# EAGLE design mains_led (EAGLE 7.5.0)
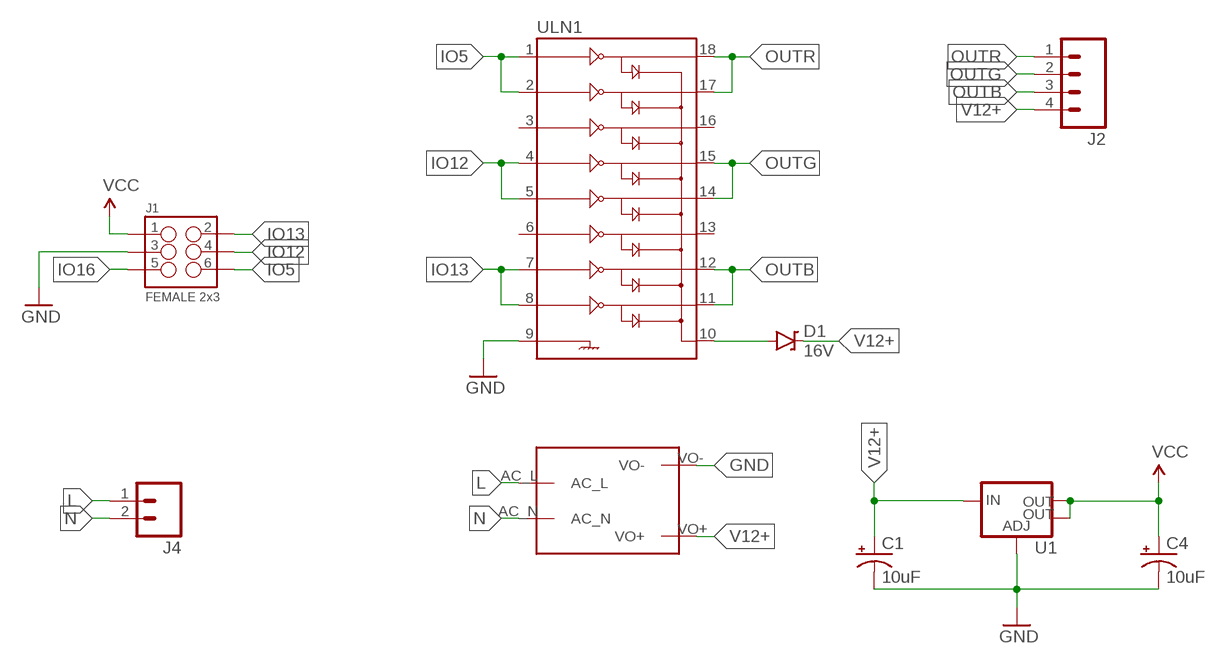
[diagram p0: schematic, sheet 1]

## Parts
C1  10uF  CAP_POL1206-KIT  [EIA3216-KIT]
C4  10uF  CAP_POL1206-KIT  [EIA3216-KIT]
D1  16V  DIODE-ZENER16V  [SOD-123]
J1  FEMALE 2x3  M03X2SHROUD  [2X3-SHROUDED]
J2  M04NO_SILK_ALL_ROUND  [1X04_NO_SILK_ALL_ROUND]
J4  M023.5MM  [SCREWTERMINAL-3.5MM-2]
U1  V_REG_LM1117SOT223  [SOT223]
U$1  MAINS_CONVERTERS  [HLK-PM01]
ULN1  ULN2803SOICW  [SO18L]

## Nets
GND: C1.C(-) C4.C(-) J1.3 U1.1(ADJ) U$1.VO- ULN1.9
IO5: J1.6 ULN1.1 ULN1.2
IO12: J1.4 ULN1.4 ULN1.5
IO13: J1.2 ULN1.7 ULN1.8
IO16: J1.5
L: J4.1 U$1.AC_L
N: J4.2 U$1.AC_N
N$1: D1.A ULN1.10
OUTB: J2.3 ULN1.11 ULN1.12
OUTG: J2.2 ULN1.14 ULN1.15
OUTR: J2.1 ULN1.17 ULN1.18
V12+: C1.A(+) D1.C J2.4 U1.3(IN) U$1.VO+
VCC: C4.A(+) J1.1 U1.2(OUT) U1.4(OUT)
Unconnected: ULN1.3 ULN1.6 ULN1.13 ULN1.16

## Library data of the parts
C1 C4 = SparkFun-Capacitors:CAP_POL: Capacitor Polarized These are standard SMD and PTH capacitors. Normally 10uF, 47uF, and 100uF in electrolytic and tantalum varieties. Always verify the external diameter of the through hole cap, it varies with capacity, voltage, and manufacturer. The EIA devices should be standard.
D1 = SparkFun-DiscreteSemi:DIODE-ZENER: Zener Diode Production Part - 8199 3.4V Zener Voltage; PROD_ID: DIO-12440
J1 = SparkFun-Connectors:M03X2: 2x3 .1" header. Shrouded, with keying- CONN-10681 SMT- CONN-11415 Pogo pins- HW-11044; PROD_ID: CONN-10681
J2 = SparkFun-Connectors:M04: Header 4 Standard 4-pin 0.1" header. Use with straight break away headers (SKU : PRT-00116), right angle break away headers (PRT-00553), swiss pins (PRT-00743), machine pins (PRT-00117), and female headers (PRT-00115). Molex polarized connector foot print use with SKU : PRT-08231 with associated crimp pins and housings. 1MM SMD Version SKU: PRT-10208; PROD_ID: CONN-09696
J4 = SparkFun-Connectors:M02: Standard 2-pin 0.1" header. Use with - straight break away headers ( PRT-00116) - right angle break away headers (PRT-00553) - swiss pins (PRT-00743) - machine pins (PRT-00117) - female headers (PRT-00115) Molex polarized connector foot print use with: PRT-08233 with associated crimp pins and housings. 2.54_SCREWTERM for use with PRT-10571. 3.5mm Screw Terminal footprints for PRT-08084 5mm Screw Terminal footprints for use with PRT-08432; PROD_ID: CONN-08399
U1 = SparkFun-PowerIC:V_REG_LM1117: Voltage Regulator LM1117 Standard adjustable voltage regulator but in SMD form. Spark Fun Electronics SKU : COM-00595; PROD_ID: VREG-08170
U$1 = captain-slow:MAINS_CONVERTERS
ULN1 = SparkFun-PowerIC:ULN2803: Darlington Driver ULN2803 Darlington array. 500mA max per channel, 8-channel package. Spark Fun Electronics SKU : COM-00312

## Board
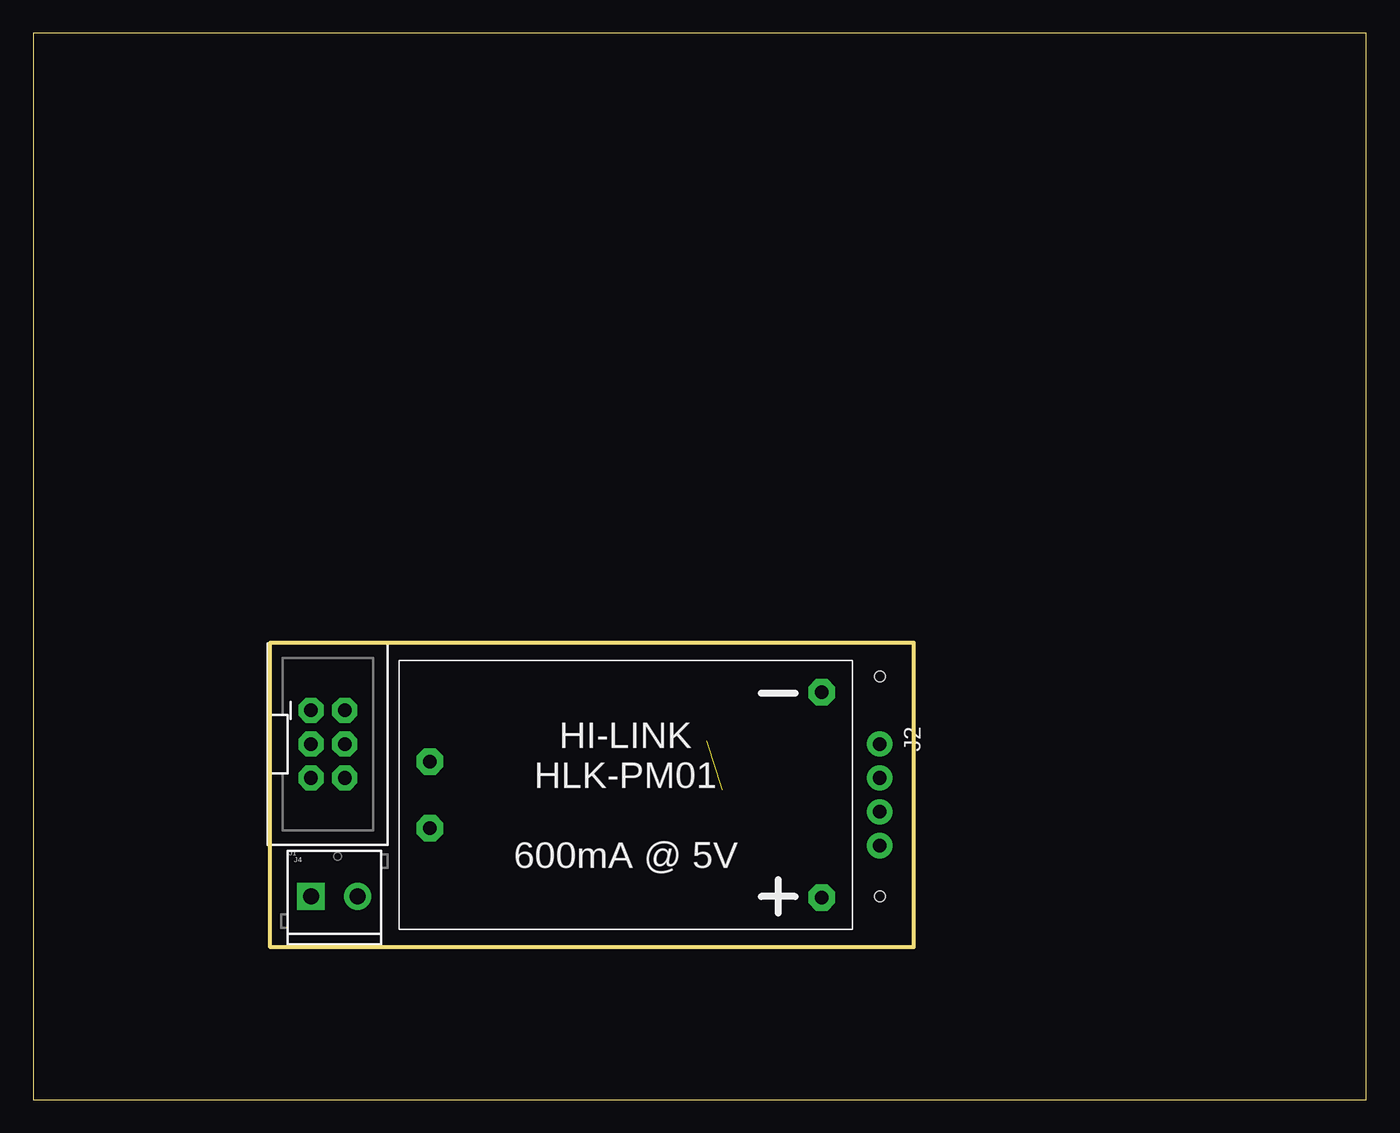
[diagram p1: board, top side]
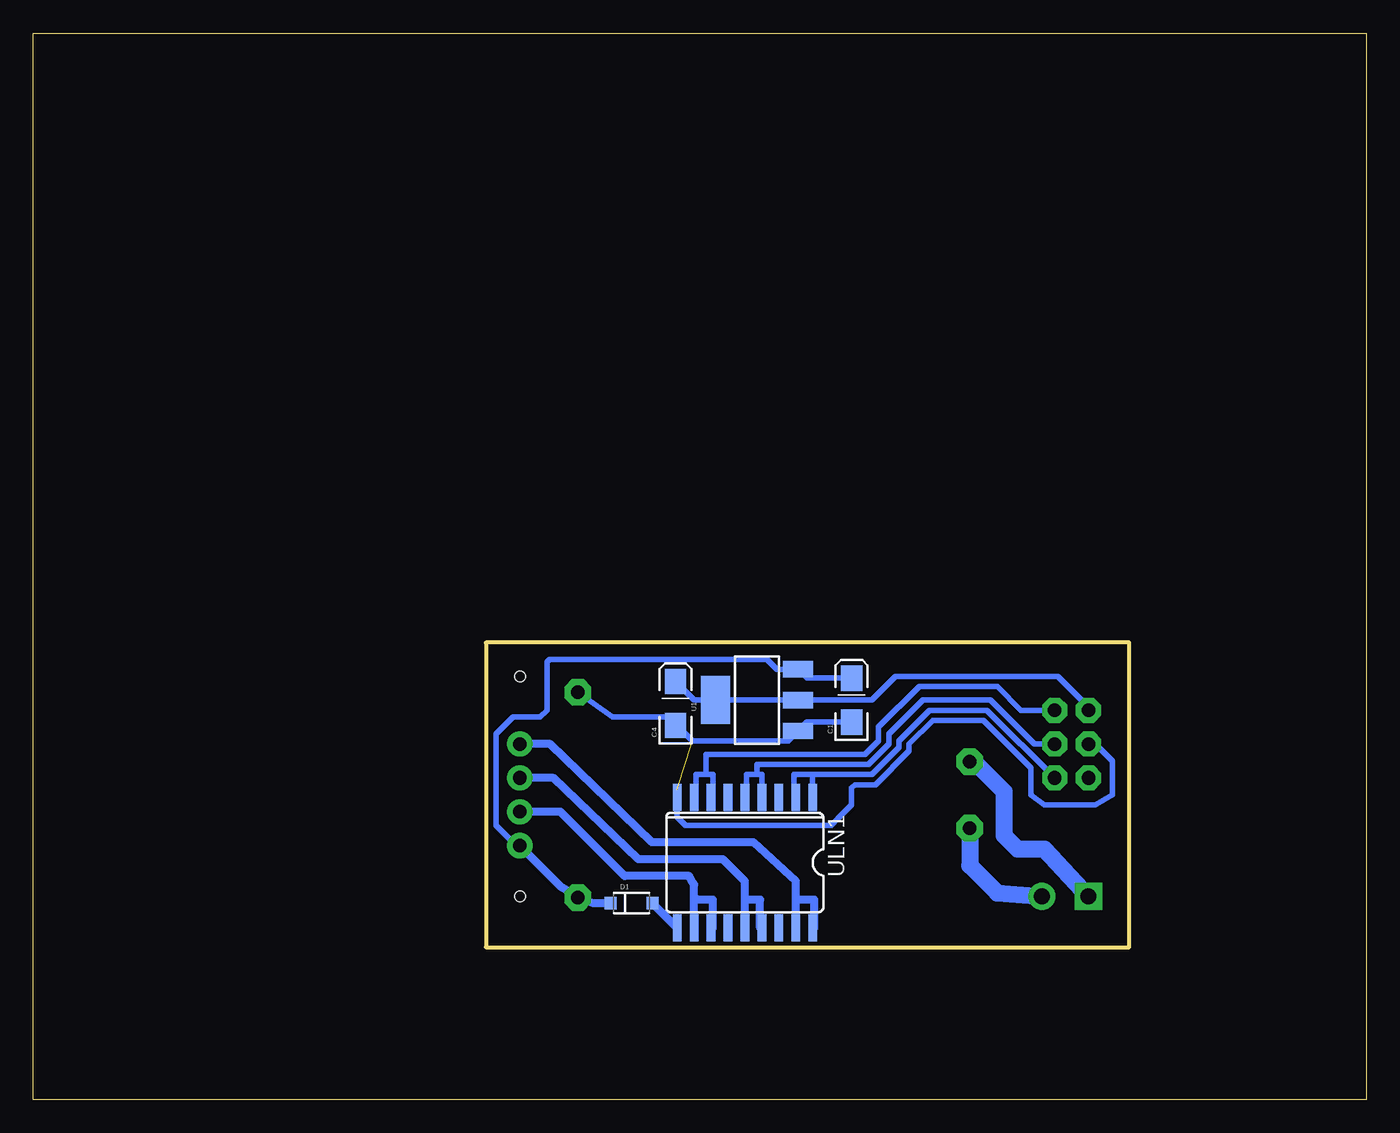
[diagram p2: board, bottom side, seen from below]

Size 100 x 80 mm. Coordinates in mm from the lower left corner, seen from the top.
Outline: 0,0 100,0 100,80 0,80 0,0
Outline: 17.78,34.29 66.04,34.29 66.04,11.43 17.78,11.43 17.78,34.29
Copper layers (1*16): Top 0.035mm / dielectric 1.5mm / Bottom 0.035mm
Design rules "default": minimum track width 10mil, minimum drill 24mil, track to track 8mil, track to pad 8mil, pad to pad 8mil, via to via 8mil, smd to smd 8mil, copper to edge 40mil, drill to drill 8mil, minimum pad ring 10mil, minimum via ring 8mil, stop-mask expansion 4mil, vias tented up to drill 0mil, thermal gap 10mil
Holes 0.8 mm at 63.5,31.75 63.5,15.24

### Footprints (pad centres in the part's own frame; a part is rotated, then mirrored left to right if it is on the bottom)
EIA3216-KIT = smd 1.9 x 1.6: A 1.65,0; C -1.65,0
SOD-123 = smd 0.9 x 0.95: A 1.575,0; C -1.575,0
2X3-SHROUDED = drill 1.016 pad 1.88 octagon: 1 -1.27,2.54; 2 1.27,2.54; 3 -1.27,0; 4 1.27,0; 5 -1.27,-2.54; 6 1.27,-2.54
1X04_NO_SILK_ALL_ROUND = drill 1.016 pad 1.88: 1 0,0; 2 2.54,0; 3 5.08,0; 4 7.62,0
SCREWTERMINAL-3.5MM-2 = drill 1.2 pad 2.032 square: 1 0,0 | drill 1.2 pad 2.032: 2 3.5,0
SOT223 = smd 1.219 x 2.235: 1 -2.311,-3.099; 2 0,-3.099; 3 2.311,-3.099 | smd 3.6 x 2.2: 4 0,3.099
HLK-PM01 = drill 1 pad 2 octagon: AC_L -14.7,2.5; AC_N -14.7,-2.5; VO+ 14.7,-7.7; VO- 14.7,7.7
SO18L = smd 0.66 x 2.032: 1 -0.635,-4.902; 2 0.635,-4.902; 3 1.905,-4.902; 4 3.175,-4.902; 5 4.445,-4.902; 6 5.715,-4.902; 7 6.985,-4.902; 8 8.255,-4.902; 9 9.525,-4.902; 10 9.525,4.902; 11 8.255,4.902; 12 6.985,4.902; 13 5.715,4.902; 14 4.445,4.902; 15 3.175,4.902; 16 1.905,4.902; 17 0.635,4.902; 18 -0.635,4.902

### Placement (x,y rotation side)
C1  38.61,29.97 90 bottom
C4  51.82,29.72 90 bottom
D1  55.12,14.73 0 bottom
J1  22.1,26.67 0 top
J2  63.5,26.67 270 top
J4  20.83,15.24 0 top
U1  45.72,29.97 90 bottom
U$1  44.45,22.86 0 top
ULN1  42.16,17.78 180 bottom

### Tracks (layer width: path | path; a pad name or v marks a point on that pad's centre or on a via)
GND  (1 unrouted)
  Bottom 0.406: C4.C 51.69,28.07 50.55,26.92 43.36,26.92 U1.1 41.96,28.32 C1.C | C4.C 52.45,28.7 56.53,28.7 U$1.VO- | 51.69,23.24 ULN1.9 51.69,21.21 51.05,20.57 40.13,20.57 39.62,21.08 38.61,22.1 38.61,23.37 38.35,23.62 36.83,23.62 34.29,26.16 34.29,26.67 32.51,28.45 28.7,28.45 25.15,24.89 25.15,22.86 24.13,22.1 20.32,22.1 19.05,22.86 19.05,25.4 20.32,26.67 J1.3 | 51.69,27.94 C4.C
IO5
  Bottom 0.406: J1.6 28.45,29.21 32.77,29.21 35.05,26.92 35.05,26.42 37.08,24.38 41.53,24.38 | ULN1.2 42.93,22.68 42.93,24.38 41.53,24.38 | 41.53,24.38 ULN1.1
IO12
  Bottom 0.406: J1.4 24.89,26.67 28.19,29.97 33.27,29.97 35.81,27.43 35.81,26.67 37.34,25.15 45.72,25.15 45.72,24.38 | ULN1.5 46.48,22.68 46.48,24.38 45.72,24.38 | 45.72,24.38 45.34,24.38 ULN1.4
IO13
  Bottom 0.406: J1.2 25.91,29.21 27.69,30.99 33.53,30.99 36.58,27.94 36.58,26.92 37.59,25.91 49.53,25.91 49.53,24.38 | ULN1.8 50.29,22.68 50.29,24.38 49.53,24.38 | 49.53,24.38 49.02,24.38 49.02,23.11 49.15,23.11 ULN1.7
L
  Bottom 1.27: U$1.AC_L 29.75,25.69 27.18,23.11 27.18,19.81 26.16,18.8 24.13,18.8 J4.1
N
  Bottom 1.27: U$1.AC_N 29.75,17.56 27.69,15.49 J4.2
N$1
  Bottom 0.406: 53.47,14.66 D1.A
  Bottom 0.61: ULN1.10 53.47,14.66
OUTB
  Bottom 0.406: ULN1.12 49.02,12.88 | 50.42,14.99 50.42,15.24
  Bottom 0.61: ULN1.11 50.42,15.24 50.42,16.13 50.8,16.76 55.63,16.76 60.45,21.59 J2.3 | 49.02,12.88 49.02,14.99 50.42,14.99
OUTG
  Bottom 0.406: ULN1.15 45.47,12.88
  Bottom 0.61: ULN1.14 46.61,14.99 | 46.61,14.99 46.61,16.38 48.26,18.03 54.61,18.03 60.96,24.13 J2.2 | 45.47,12.88 45.47,14.99 46.61,14.99
OUTR
  Bottom 0.406: ULN1.18 41.4,12.88
  Bottom 0.61: ULN1.17 42.8,14.99 | 42.8,14.99 42.8,16.38 45.97,19.3 53.59,19.3 61.21,26.67 J2.1 | 41.4,12.88 41.4,14.99 42.8,14.99
V12+
  Bottom 0.406: 38.31,31.32 C1.A 41.96,31.62 U1.3 44.22,32.28 44.96,33.02 61.27,33.02 61.47,32.82 61.47,29.21 61.98,28.7 64.01,28.7 65.28,27.43 65.28,20.57 63.75,19.05 J2.4
  Bottom 0.61: D1.C 57.96,14.73 U$1.VO+ 60.37,15.92 J2.4
VCC
  Bottom 0.406: C4.A 50.42,29.97 U1.4 U1.2 37.08,29.97 35.31,31.75 23.11,31.75 20.83,29.46 J1.1